# Altium schematic sheet MUX.SchDoc
size A
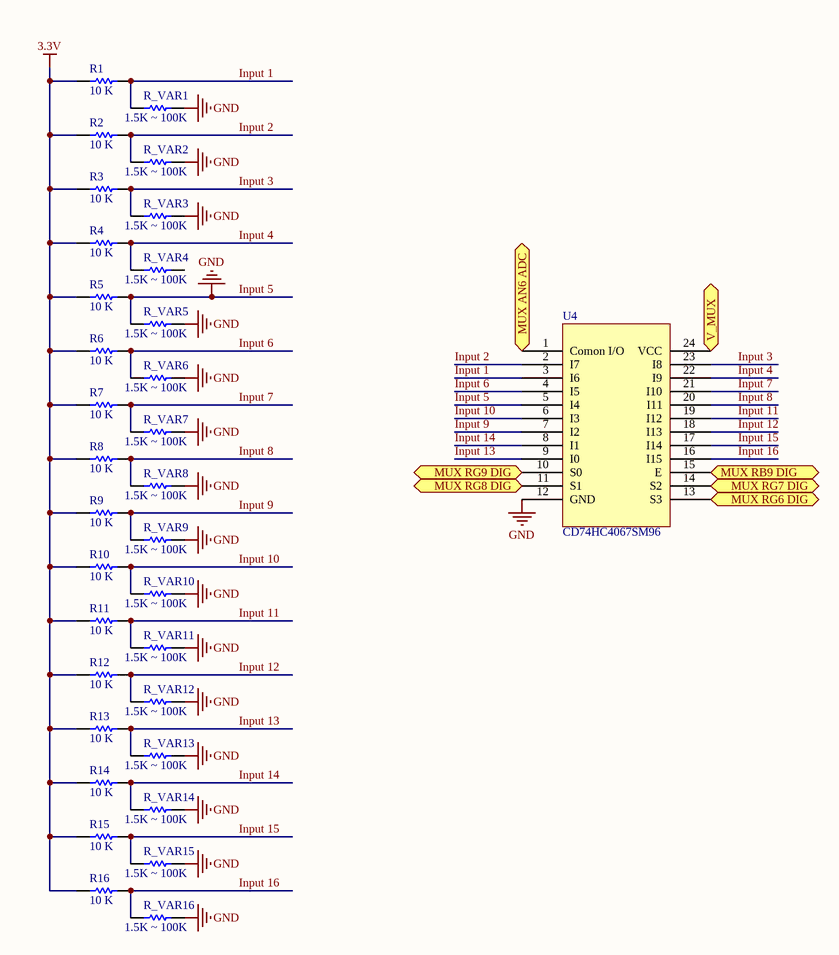
[diagram p0: MUX.SchDoc]

## Parts
R1  10 K  [Resistor0603]
R2  10 K  [Resistor0603]
R3  10 K  [Resistor0603]
R4  10 K  [Resistor0603]
R5  10 K  [Resistor0603]
R6  10 K  [Resistor0603]
R7  10 K  [Resistor0603]
R8  10 K  [Resistor0603]
R9  10 K  [Resistor0603]
R10  10 K  [Resistor0603]
R11  10 K  [Resistor0603]
R12  10 K  [Resistor0603]
R13  10 K  [Resistor0603]
R14  10 K  [Resistor0603]
R15  10 K  [Resistor0603]
R16  10 K  [Resistor0603]
R_VAR1  1.5K ~ 100K  [OrderPiece]
R_VAR2  1.5K ~ 100K  [OrderPiece]
R_VAR3  1.5K ~ 100K  [OrderPiece]
R_VAR4  1.5K ~ 100K  [OrderPiece]
R_VAR5  1.5K ~ 100K  [OrderPiece]
R_VAR6  1.5K ~ 100K  [OrderPiece]
R_VAR7  1.5K ~ 100K  [OrderPiece]
R_VAR8  1.5K ~ 100K  [OrderPiece]
R_VAR9  1.5K ~ 100K  [OrderPiece]
R_VAR10  1.5K ~ 100K  [OrderPiece]
R_VAR11  1.5K ~ 100K  [OrderPiece]
R_VAR12  1.5K ~ 100K  [OrderPiece]
R_VAR13  1.5K ~ 100K  [OrderPiece]
R_VAR14  1.5K ~ 100K  [OrderPiece]
R_VAR15  1.5K ~ 100K  [OrderPiece]
R_VAR16  1.5K ~ 100K  [OrderPiece]
U4  CD74HC4067SM96  [MUX]

## Ports
MUX AN6 ADC, MUX RB9 DIG, MUX RG6 DIG, MUX RG7 DIG, MUX RG8 DIG, MUX RG9 DIG, V_MUX

## Nets
3.3V: R1.1 R2.1 R3.1 R4.1 R5.1 R6.1 R7.1 R8.1 R9.1 R10.1 R11.1 R12.1 R13.1 R14.1 R15.1 R16.1
Input 5: R5.2 R_VAR1.2 R_VAR2.2 R_VAR3.2 R_VAR5.1 R_VAR5.2 R_VAR6.2 R_VAR7.2 R_VAR8.2 R_VAR9.2 R_VAR10.2 R_VAR11.2 R_VAR12.2 R_VAR13.2 R_VAR14.2 R_VAR15.2 R_VAR16.2 U4.5(I4) U4.12(GND)  [also labelled GND]
Input 1: R1.2 R_VAR1.1 U4.3(I6)
Input 2: R2.2 R_VAR2.1 U4.2(I7)
Input 3: R3.2 R_VAR3.1 U4.23(I8)
Input 4: R4.2 R_VAR4.1 U4.22(I9)
Input 6: R6.2 R_VAR6.1 U4.4(I5)
Input 7: R7.2 R_VAR7.1 U4.21(I10)
Input 8: R8.2 R_VAR8.1 U4.20(I11)
Input 9: R9.2 R_VAR9.1 U4.7(I2)
Input 10: R10.2 R_VAR10.1 U4.6(I3)
Input 11: R11.2 R_VAR11.1 U4.19(I12)
Input 12: R12.2 R_VAR12.1 U4.18(I13)
Input 13: R13.2 R_VAR13.1 U4.9(I0)
Input 14: R14.2 R_VAR14.1 U4.8(I1)
Input 15: R15.2 R_VAR15.1 U4.17(I14)
Input 16: R16.2 R_VAR16.1 U4.16(I15)
MUX AN6 ADC: U4.1(Comon_I/O) ; port MUX AN6 ADC
MUX RB9 DIG: U4.15(E) ; port MUX RB9 DIG
MUX RG6 DIG: U4.13(S3) ; port MUX RG6 DIG
MUX RG7 DIG: U4.14(S2) ; port MUX RG7 DIG
MUX RG8 DIG: U4.11(S1) ; port MUX RG8 DIG
MUX RG9 DIG: U4.10(S0) ; port MUX RG9 DIG
V_MUX: U4.24(VCC) ; port V_MUX

Not connected (* = marked no-connect by the designer): R_VAR4 2

## Library data of the parts
R1-R16 R_VAR1-R_VAR16 = Res1: Resistor; Published: 8-Jun-2000; LatestRevisionDate: 17-Jul-2002; LatestRevisionNote: Re-released for DXP Platform.; PackageReference: AXIAL-0.3; Publisher: Altium Limited; PackageDescription: Axial Device, Thru-Hole; 2 Leads; 0.3 in Pin Spacing
  R1-R16: Value: 10 K
  R_VAR1-R_VAR16: Value: 1.5K ~ 100K
U4 = Analog Multiplexor: Farnell Reference: 1601157